# EAGLE design QS40_pcb_1.6.2 (EAGLE 9.6.2)
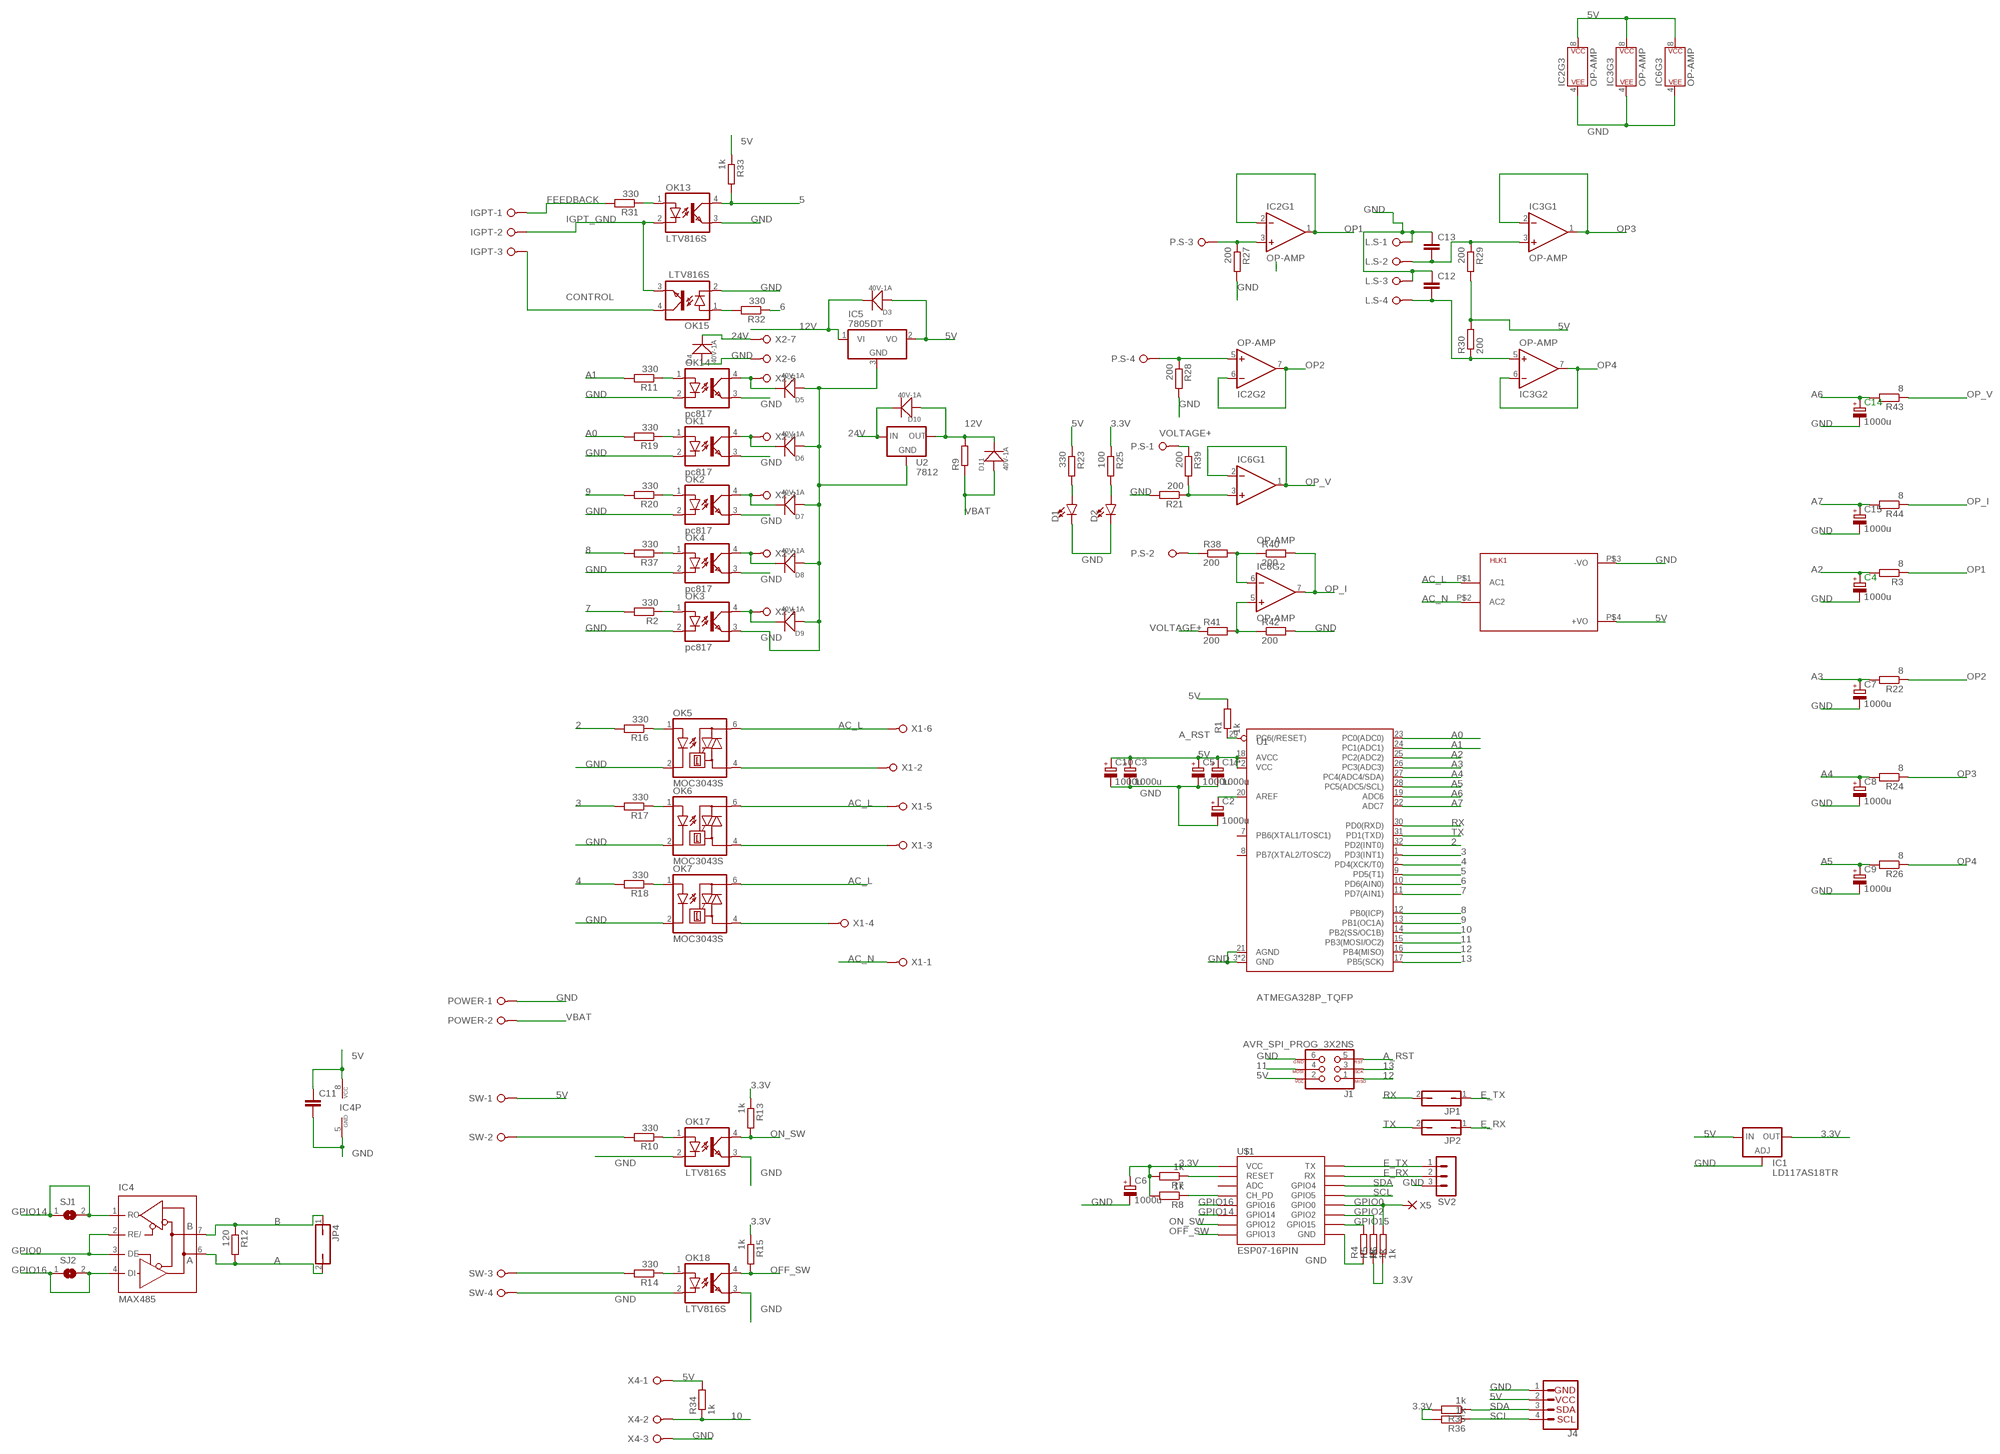
[diagram p0: schematic, sheet 1]

## Parts
C1  1000u  CPOL-EUUD-8X10  [UD-8X10_NICHICON]
C2  1000u  CPOL-EUUD-8X10  [UD-8X10_NICHICON]
C3  1000u  CPOL-EUUD-8X10  [UD-8X10_NICHICON]
C4  1000u  CPOL-EUUD-8X10  [UD-8X10_NICHICON]
C5  1000u  CPOL-EUUD-8X10  [UD-8X10_NICHICON]
C6  1000u  CPOL-EUUD-8X10  [UD-8X10_NICHICON]
C7  1000u  CPOL-EUUD-8X10  [UD-8X10_NICHICON]
C8  1000u  CPOL-EUUD-8X10  [UD-8X10_NICHICON]
C9  1000u  CPOL-EUUD-8X10  [UD-8X10_NICHICON]
C10  1000u  CPOL-EUUD-8X10  [UD-8X10_NICHICON]
C11  C-EUC1206K  [C1206K]
C12  C-EUC1206  [C1206]
C13  C-EUC1206  [C1206]
C14  1000u  CPOL-EUUD-8X10  [UD-8X10_NICHICON]
C15  1000u  CPOL-EUUD-8X10  [UD-8X10_NICHICON]
D1  LED-FKIT-1206  [FKIT-LED-1206]
D2  LED-FKIT-1206  [FKIT-LED-1206]
D3  40V-1A  SMD-DIODE-SCHOTTKY-40V-1A(DO-214AC)  [DO-214AC]
D4  40V-1A  SMD-DIODE-SCHOTTKY-40V-1A(DO-214AC)  [DO-214AC]
D5  40V-1A  SMD-DIODE-SCHOTTKY-40V-1A(DO-214AC)  [DO-214AC]
D6  40V-1A  SMD-DIODE-SCHOTTKY-40V-1A(DO-214AC)  [DO-214AC]
D7  40V-1A  SMD-DIODE-SCHOTTKY-40V-1A(DO-214AC)  [DO-214AC]
D8  40V-1A  SMD-DIODE-SCHOTTKY-40V-1A(DO-214AC)  [DO-214AC]
D9  40V-1A  SMD-DIODE-SCHOTTKY-40V-1A(DO-214AC)  [DO-214AC]
D10  40V-1A  SMD-DIODE-SCHOTTKY-40V-1A(DO-214AC)  [DO-214AC]
D11  40V-1A  SMD-DIODE-SCHOTTKY-40V-1A(DO-214AC)  [DO-214AC]
HLK1  HLK-PM013W  [HLK-PM01]
IC1  LD117AS18TR  [SOT223]
IC2  OP-AMP  OPAMP-DUALU  [SO08]
IC3  OP-AMP  OPAMP-DUALU  [SO08]
IC4  MAX485  MAX481CSA  [SO08]
IC5  7805DT  [TO252]
IC6  OP-AMP  OPAMP-DUALU  [SO08]
IGPT  W237-03P  [W237-133]
J1  AVR_SPI_PROG_3X2NS  [2X3-NS]
J4  I2C_STANDARD_NO_SILK  [1X04_NO_SILK]
JP1  JP1Q  [JP1]
JP2  JP1Q  [JP1]
JP4  JP1Q  [JP1]
L.S  W237-04P  [W237-4P]
OK1  pc817  LTV816S  [DIL4-SMD]
OK2  pc817  LTV816S  [DIL4-SMD]
OK3  pc817  LTV816S  [DIL4-SMD]
OK4  pc817  LTV816S  [DIL4-SMD]
OK5  MOC3043S  [DIL6-SMD]
OK6  MOC3043S  [DIL6-SMD]
OK7  MOC3043S  [DIL6-SMD]
OK13  LTV816S  [DIL4-SMD]
OK14  pc817  LTV816S  [DIL4-SMD]
OK15  LTV816S  [DIL4-SMD]
OK17  LTV816S  [DIL4-SMD]
OK18  LTV816S  [DIL4-SMD]
P.S  W237-04P  [W237-4P]
POWER  W237-02P  [W237-132]
R1  1k  R-EU_R1206W  [R1206W]
R2  330  R-EU_R1206W  [R1206W]
R3  8  R-EU_R1206W  [R1206W]
R4  1k  R-EU_R1206W  [R1206W]
R5  1k  R-EU_R1206W  [R1206W]
R6  1k  R-EU_R1206W  [R1206W]
R7  1k  R-EU_R1206W  [R1206W]
R8  1k  R-EU_R1206W  [R1206W]
R9  R-EU_R5025  [R5025]
R10  330  R-EU_R1206W  [R1206W]
R11  330  R-EU_R1206W  [R1206W]
R12  120  R-EU_R1206W  [R1206W]
R13  1k  R-EU_R1206W  [R1206W]
R14  330  R-EU_R1206W  [R1206W]
R15  1k  R-EU_R1206W  [R1206W]
R16  330  R-EU_R1206W  [R1206W]
R17  330  R-EU_R1206W  [R1206W]
R18  330  R-EU_R1206W  [R1206W]
R19  330  R-EU_R1206W  [R1206W]
R20  330  R-EU_R1206W  [R1206W]
R21  200  R-EU_R1206  [R1206]
R22  8  R-EU_R1206W  [R1206W]
R23  330  R-EU_R1206W  [R1206W]
R24  8  R-EU_R1206W  [R1206W]
R25  100  R-EU_R1206W  [R1206W]
R26  8  R-EU_R1206W  [R1206W]
R27  200  R-EU_R1206  [R1206]
R28  200  R-EU_R1206  [R1206]
R29  200  R-EU_R1206W  [R1206W]
R30  200  R-EU_R1206W  [R1206W]
R31  330  R-EU_R1206W  [R1206W]
R32  330  R-EU_R1206W  [R1206W]
R33  1k  R-EU_R1206W  [R1206W]
R34  1k  R-EU_R1206W  [R1206W]
R35  1k  R-EU_R1206W  [R1206W]
R36  1k  R-EU_R1206W  [R1206W]
R37  330  R-EU_R1206W  [R1206W]
R38  200  R-EU_R1206  [R1206]
R39  200  R-EU_R1206  [R1206]
R40  200  R-EU_R1206  [R1206]
R41  200  R-EU_R1206  [R1206]
R42  200  R-EU_R1206  [R1206]
R43  8  R-EU_R1206W  [R1206W]
R44  8  R-EU_R1206W  [R1206W]
SJ1  SJ  [SJ]
SJ2  SJ  [SJ]
SV2  MA03-1  [MA03-1]
SW  W237-04P  [W237-4P]
U1  ATMEGA328P_TQFP  [TQFP32-08]
U2  7812  V_REG_78XX7812  [TO-252]
U$1  ESP07-16PIN  [ESP07]
X1  W237-06P  [W237-6P]
X2  W237-07P  [W237-7P]
X4  W237-03P  [W237-133]
X5  PAD-1.00-2.00  [PAD-1.00-2.00]

## Nets
2: R16.2 U1.32(PD2(INT0))
3: R17.2 U1.1(PD3(INT1))
3.3V: C6.+ IC1.4(OUT) R5.1 R6.1 R7.2 R8.2 R13.1 R15.1 R25.1 R35.2 R36.2 U$1.VCC
4: R18.2 U1.2(PD4(XCK/T0))
5: OK13.4(COL) R33.2 U1.9(PD5(T1))
5V: C1.+ C3.+ C5.+ C10.+ C11.1 D3.1(+) HLK1.P$4(+VO) IC1.3(IN) IC2.8(P$V+) IC3.8(P$V+) IC4.8(VCC) IC5.2(VO) IC6.8(P$V+) J1.2 J4.2 R1.2 R23.1 R29.2 R30.2 R33.1 R34.2 SW.1 U1.4(VCC) U1.6(VCC) U1.18(AVCC) X4.1
6: R32.1 U1.10(PD6(AIN0))
7: R2.2 U1.11(PD7(AIN1))
8: R37.2 U1.12(PB0(ICP))
9: R20.2 U1.13(PB1(OC1A))
10: R34.1 U1.14(PB2(SS/OC1B)) X4.2
11: J1.4 U1.15(PB3(MOSI/OC2))
12: J1.1 U1.16(PB4(MISO))
12V: D3.2(-) D10.1(+) D11.2(-) IC5.1(VI) R9.2 U2.2(OUT)
13: J1.3 U1.17(PB5(SCK))
24V: D4.2(-) D10.2(-) U2.1(IN) X2.7
A: IC4.6(A) JP4.2 R12.2
A0: R19.2 U1.23(PC0(ADC0))
A1: R11.2 U1.24(PC1(ADC1))
A2: C4.+ R3.2 U1.25(PC2(ADC2))
A3: C7.+ R22.2 U1.26(PC3(ADC3))
A4: C8.+ R24.2 U1.27(PC4(ADC4/SDA))
A5: C9.+ R26.2 U1.28(PC5(ADC5/SCL))
A6: C14.+ R43.2 U1.19(ADC6)
A7: C15.+ R44.2 U1.22(ADC7)
A_RST: J1.5 R1.1 U1.29(PC6(/RESET))
AC_L: HLK1.P$1(AC1) OK5.6(A2) OK6.6(A2) OK7.6(A2) X1.5 X1.6
AC_N: HLK1.P$2(AC2) X1.1
B: IC4.7(B) JP4.1 R12.1
CONTROL: IGPT.3 OK15.4(COL)
E_RX: JP2.1 SV2.2 U$1.RX
E_TX: JP1.1 SV2.1 U$1.TX
FEEDBACK: IGPT.1 R31.2
GND: C1.- C2.- C3.- C4.- C5.- C6.- C7.- C8.- C9.- C10.- C11.2 C12.1 C13.1 C14.- C15.- D1.C D2.C D4.1(+) D5.1(+) D6.1(+) D7.1(+) D8.1(+) D9.1(+) HLK1.P$3(-VO) IC1.1(ADJ) IC2.4(P$V-) IC3.4(P$V-) IC4.5(GND) IC5.3(GND) IC6.4(P$V-) J1.6 J4.1 L.S.1 L.S.3 OK1.2(C) OK1.3(EMIT) OK2.2(C) OK2.3(EMIT) OK3.2(C) OK3.3(EMIT) OK4.2(C) OK4.3(EMIT) OK5.2(C) OK6.2(C) OK7.2(C) OK13.3(EMIT) OK14.2(C) OK14.3(EMIT) OK15.2(C) OK17.2(C) OK17.3(EMIT) OK18.2(C) OK18.3(EMIT) POWER.1 R4.1 R21.2 R27.2 R28.2 R42.2 SV2.3 SW.4 U1.3(GND) U1.5(GND) U1.21(AGND) U2.3(GND) U$1.GND X2.6 X4.3
GPIO0: IC4.2(RE/) IC4.3(DE) R6.2 U$1.GPIO0 X5.1(P)
GPIO2: R5.2 U$1.GPIO2
GPIO14: IC4.1(RO) SJ1.1 SJ1.2 U$1.GPIO14
GPIO15: R4.2 U$1.GPIO15
GPIO16: IC4.4(DI) SJ2.1 SJ2.2 U$1.GPIO16
IGPT_GND: IGPT.2 OK13.2(C) OK15.3(EMIT)
N$1: OK5.4(A1) X1.2
N$2: IC2.3(+IN) P.S.3 R27.1
N$3: R7.1 U$1.REST(RESET)
N$4: R8.1 U$1.CH_PD
N$5: C2.+ U1.20(AREF)
N$6: OK7.4(A1) X1.4
N$7: OK14.1(A) R11.1
N$8: OK3.1(A) R2.1
N$9: OK1.1(A) R19.1
N$10: OK6.4(A1) X1.3
N$11: OK2.1(A) R20.1
N$12: OK4.1(A) R37.1
N$13: C13.2 IC3.3(+IN) L.S.2 R29.1
N$14: D1.A R23.2
N$15: D2.A R25.2
N$16: D5.2(-) OK14.4(COL) X2.5
N$17: D6.2(-) OK1.4(COL) X2.4
N$18: D7.2(-) OK2.4(COL) X2.3
N$19: C12.2 IC3.5(+IN) L.S.4 R30.1
N$20: OK15.1(A) R32.2
N$21: IC2.5(+IN) P.S.4 R28.1
N$22: D8.2(-) OK4.4(COL) X2.2
N$23: D9.2(-) OK3.4(COL) X2.1
N$24: OK17.1(A) R10.1
N$26: P.S.2 R38.1
N$27: OK5.1(A) R16.1
N$29: R10.2 SW.2
N$30: OK18.1(A) R14.1
N$31: IC6.5(+IN) R41.2 R42.1
N$32: IC6.3(+IN) R21.1 R39.2
N$33: OK6.1(A) R17.1
N$34: IC6.6(-IN) R38.2 R40.1
N$35: R14.2 SW.3
N$37: OK7.1(A) R18.1
N$48: OK13.1(A) R31.1
OFF_SW: OK18.4(COL) R15.2 U$1.GPIO13
ON_SW: OK17.4(COL) R13.2 U$1.GPIO12
OP1: IC2.1(OUT) IC2.2(-IN) R3.1
OP2: IC2.6(-IN) IC2.7(OUT) R22.1
OP3: IC3.1(OUT) IC3.2(-IN) R24.1
OP4: IC3.6(-IN) IC3.7(OUT) R26.1
OP_I: IC6.7(OUT) R40.2 R44.1
OP_V: IC6.1(OUT) IC6.2(-IN) R43.1
RX: JP1.2 U1.30(PD0(RXD))
SCL: J4.4 R36.1 U$1.GPIO5
SDA: J4.3 R35.1 U$1.GPIO4
TX: JP2.2 U1.31(PD1(TXD))
VBAT: D11.1(+) POWER.2 R9.1
VOLTAGE+: P.S.1 R39.1 R41.1
Unconnected: U1.7(PB6(XTAL1/TOSC1)) U1.8(PB7(XTAL2/TOSC2)) U$1.ADC

## Library data of the parts
C1-C10 C14 C15 = rcl:CPOL-EU: POLARIZED CAPACITOR, European symbol; SPICEPREFIX: C
C11-C13 = rcl:C-EU: CAPACITOR, European symbol; SPICEPREFIX: C
D1 D2 = SparkFun-LED:LED: LED (Generic) Standard schematic elements and footprints for 5mm, 3mm, 1206, and 0603 sized LEDs. Generic LEDs with no color specified.
D3-D11 = Seeed-OPL-Diode:SMD-DIODE-SCHOTTKY-40V-1A(DO-214AC): 304020027; MPN: 1N5819
HLK1 = HLK-PM01:HLK-PM01: Hi-Link Power Supply HLK-PM01 3W Author: Ahmed Said <https://github.com/AhmedSaid/EAGLELibraries>
IC1 = v-reg:LD117A?*: Low drop fixed and adjustable positive voltage regulators 1 A Source: http://www.st.com/stonline/products/literature/ds/7194/ld1117axx.pdf
IC2 IC3 IC6 = SparkFun-IC-Amplifiers:OPAMP-DUAL: Generic op-amp footprint This component is for the standard 358 pinning of a dual op-amp From the LM358 datasheet: Pin 1: Output A Pin 2: Inverting Input A Pin 3: Non-Inverting Input A Pin 4: Gnd Pin 5: Non-Inverting Input B Pin 6: Inverting Input B Pin 7: Output B Pin 8: V+; PROD_ID: NA-XXXXX
IC4 = maxim:MAX481CSA: RS485 TRANSEIVER; MF: MAXIM; MPN: MAX481CSA; OC_FARNELL: unknown; OC_NEWARK: 90C3817
IC5 = linear:78*: Positive VOLTAGE REGULATOR Source: http://cache.national.com/ds/LM/LM78L05.pdf http://www.fairchildsemi.com/ds/LM/LM7805.pdf
IGPT X4 = con-wago-508:W237-03P: WAGO SREW CLAMP; OC_FARNELL: unknown; OC_NEWARK: unknown
J1 = SparkFun-Connectors:AVR_SPI_PROG_3X2: AVR ISP 6 Pin This is the reduced ISP connector for AVR programming. Common on Arduino. This footprint will take up less PCB space and can be used with a 10-pin to 6-pin adapter such as SKU: BOB-08508 **Special note about "TEST_POINT" package. The stop mask is on the top side, so if you want your programming test points to be on the bottom of your board, make sure to place this package on the bottom side of the board. This also ensure that the orientation to program from the bottom side will be correct. SparkFun Products: SparkFun ISP Pogo Adapter <https://www.sparkfun.com/products/11591> - NS Tiny AVR Programmer <https://www.sparkfun.com/products/11801> -PTH
J4 = SparkFun-Connectors:I2C_STANDARD: SparkFun I2C Standard Pinout Header SparkFun has standardized on a pinout for all I2C based sensor breakouts. This pinout allows I2C boards to be plugged directly into the headers on Arduino Uno compatible boards, and to be daisy chained easily. Example SparkFun Products: SparkFun Atmospheric Sensor Breakout - BME280 <https://www.sparkfun.com/products/13676> SparkFun Altitude/Pressure Sensor Breakout - MPL3115A2 <https://www.sparkfun.com/products/11084> SparkFun TOF Range Finder Sensor - VL6180 <https://www.sparkfun.com/products/12785>
JP1 JP2 JP4 = jumper:JP1Q: JUMPER
L.S P.S SW = con-wago-508:W237-04P: WAGO SREW CLAMP; OC_FARNELL: unknown; OC_NEWARK: unknown
OK1-OK4 OK13-OK15 OK17 OK18 = optocoupler:LTV816: OPTO COUPLER Source: LITEON, LTV816.pdf
OK5-OK7 = optocoupler:MOC30*: 6-Pin DIP Zero-Cross Optoisolators Triac Driver Output (250/400 Volt Peak) Source: Data sheet <http://www.fairchildsemi.com/ds/MO/MOC3031M.pdf> The old path of data sheet not more available 2013-05-06.; MF: FAIRCHILD SEMICONDUCTOR; MPN: MOC3043SM; OC_FARNELL: 1505441; OC_NEWARK: 78K6091
POWER = con-wago-508:W237-02P: WAGO SREW CLAMP; OC_FARNELL: unknown; OC_NEWARK: unknown
R1-R44 = rcl:R-EU_: RESISTOR, European symbol; SPICEPREFIX: R
SJ1 SJ2 = jumper:SJ: SMD solder JUMPER
SV2 = con-lstb:MA03-1: PIN HEADER; OC_FARNELL: unknown; OC_NEWARK: unknown
U1 = SparkFun-IC-Microcontroller:ATMEGA328P_TQFP: Popular 328P in QFP Storefront component: ATmega328 - TQFP <https://www.sparkfun.com/products/13448> (COM-13448) Datasheet <http://www.sparkfun.com/datasheets/Components/SMD/ATMega328.pdf> SparkFun Products SparkFun RedBoard - Programmed with Arduino <https://www.sparkfun.com/products/12757> (DEV-12757) Arduino Pro Mini 328 - 5V/16MHz <https://www.sparkfun.com/products/11113> (DEV-11113) Arduino Pro Mini 328 - 3.3V/8MHz <https://www.sparkfun.com/products/11114> (DEV-11114) SparkFun OpenLog <https://www.sparkfun.com/products/13712> (DEV-13712) SparkFun MicroView - OLED Arduino Module <https://www.sparkfun.com/products/12923> (DEV-12923) SparkFun Digital Sandbox <https://www.sparkfun.com/products/12651> (DEV-12651) SparkFun PicoBoard <https://www.sparkfun.com/products/11888> (WIG-11888) Arduino Fio <https://www.sparkfun.com/products/10116> (DEV-10116) LilyPad Arduino 328 Main Board <https://www.sparkfun.com/products/13342> (DEV-13342) SparkFun RedStick <https://www.sparkfun.com/products/13741> (DEV-13741) LilyPad MP3 <https://www.sparkfun.com/products/11013> (DEV-11013) LilyPad Arduino SimpleSnap <https://www.sparkfun.com/products/10941> (DEV-10941) SparkFun Stepoko <https://www.sparkfun.com/products/13899> (ROB-13899) SparkFun Geiger Counter <https://www.sparkfun.com/products/11345> (SEN-11345) SparkFun EL Sequencer <https://www.sparkfun.com/products/12781> (COM-12781) Arduino Pro 328 - 5V/16MHz <https://www.sparkfun.com/products/10915> (DEV-10915) CryptoCape <https://www.sparkfun.com/products/12773> (DEV-12773) SparkFun IR Thermometer Evaluation Board - MLX90614 <https://www.sparkfun.com/products/10740> (SEN-10740) SparkFun RedBot Mainboard <https://www.sparkfun.com/products/12097> (ROB-12097) Arduino Pro 328 - 3.3V/8MHz <https://www.sparkfun.com/products/10914> (DEV-10914) SparkFun Block for Intel® Edison - Arduino <https://www.sparkfun.com/products/13036> (DEV-13036) SparkFun Simon Says - Surface Mount Soldering Kit <https://www.sparkfun.com/products/10935> (KIT-10935) SparkFun 7-Segment Serial Display - Red <https://www.sparkfun.com/products/11441> (COM-11441) SparkFun 7-Segment Serial Display - White <https://www.sparkfun.com/products/11629> (COM-11629) SparkFun 7-Segment Serial Display - Yellow <https://www.sparkfun.com/products/11443> (COM-11443) SparkFun 7-Segment Serial Display - Kelly Green <https://www.sparkfun.com/products/11440> (COM-11440) SparkFun 7-Segment Serial Display - Blue <https://www.sparkfun.com/products/11442> (COM-11442) SparkFun OpenSegment Serial Display - 20mm (Blue) <https://www.sparkfun.com/products/11647> (COM-11647) SparkFun OpenSegment Serial Display - 20mm (Green) <https://www.sparkfun.com/products/11646> (COM-11646) SparkFun OpenSegment Serial Display - 20mm (White) <https://www.sparkfun.com/products/11648> (COM-11648) SparkFun OpenSegment Serial Display - 20mm (Red) <https://www.sparkfun.com/products/11644> (COM-11644) SparkFun OpenSegment Serial Display - 20mm (Yellow) <https://www.sparkfun.com/products/11645> (COM-11645) SparkFun OpenSegment Shield <https://www.sparkfun.com/products/13190> (DEV-13190); PROD_ID: IC-09069
U2 = SparkFun-IC-Power:V_REG_78XX: Voltage Regulator Standard 78xx regulator. IGO (Input Ground Output). Spark Fun Electronics SKU : COM-00107; PROD_ID: VREG-12370; VALUE: +12v
U$1 = SparkFun-RF:ESP07-16PIN: Espressif ESP-07S WiFi-compatible SoC microcontroller. 16 GPIO pins User Guide <https://www.tinyosshop.com/datasheet/ESP-07S_User_Manual.pdf>; PROD_ID: IC-13915
X1 = con-wago-508:W237-06P: WAGO SREW CLAMP; OC_FARNELL: unknown; OC_NEWARK: unknown
X2 = con-wago-508:W237-07P: WAGO SREW CLAMP; OC_FARNELL: unknown; OC_NEWARK: unknown
X5 = we-rcl:PAD: Pad / Test-Point

## Board
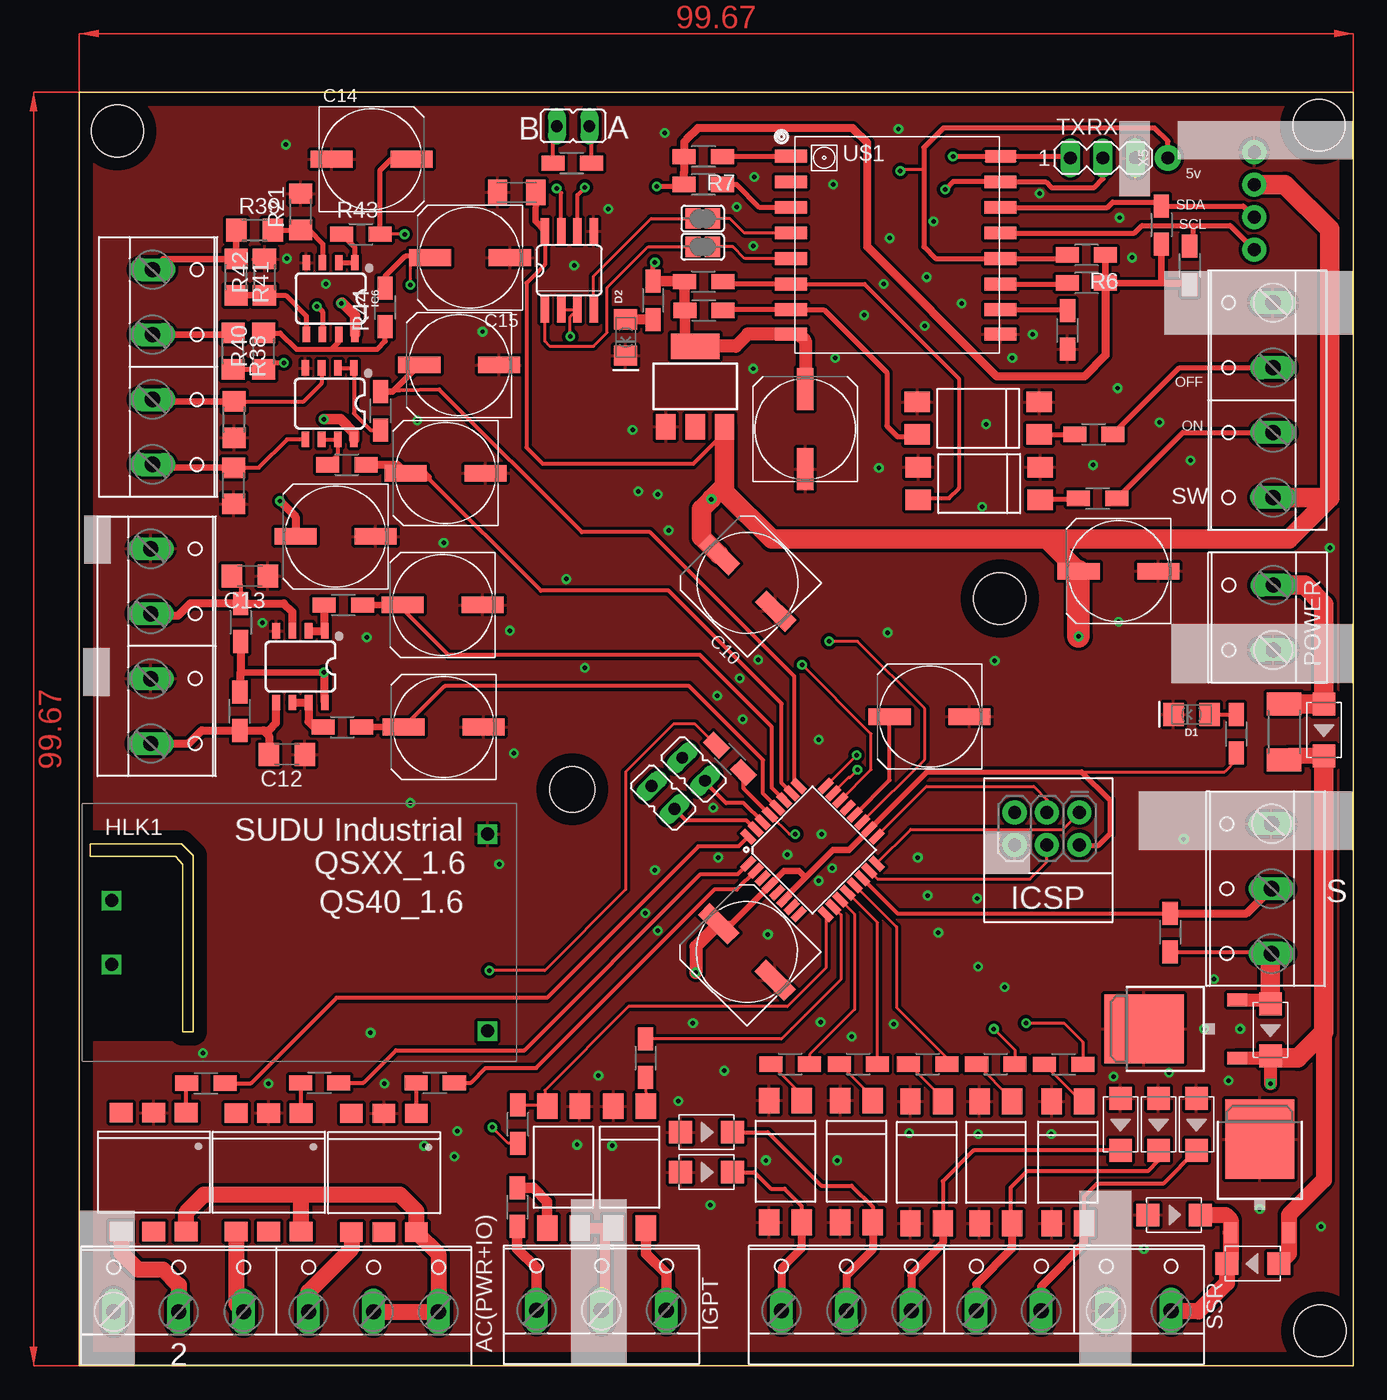
[diagram p1: board, top side]
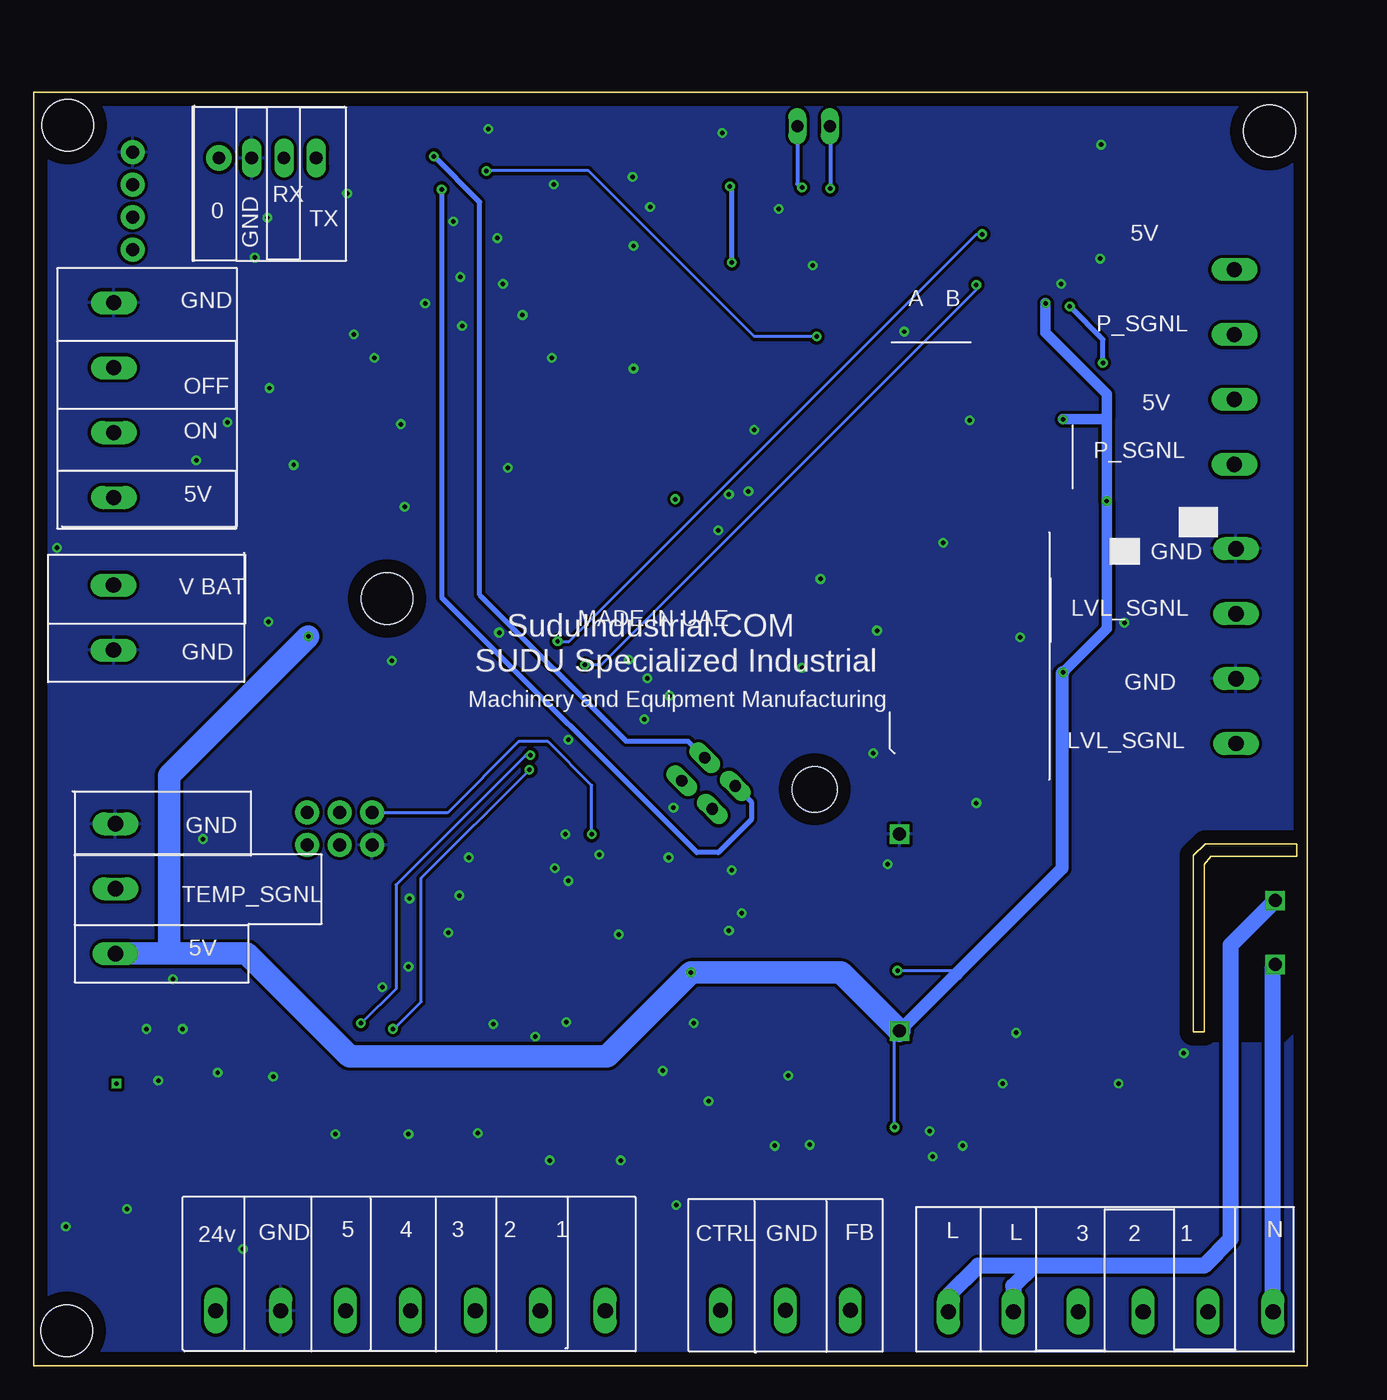
[diagram p2: board, bottom side, seen from below]

Size 99.67 x 99.67 mm. Coordinates in mm from the lower left corner, seen from the top.
Outline: 0,99.67 0,0 99.67,0 99.67,99.67 0,99.67
Outline: 0.84,40.84 8,40.84 8.92,39.93 8.92,26.14 8.08,26.14 8.08,39.24 7.54,39.85 0.84,39.85 0.84,40.84
Copper layers (1*16): Top 0.035mm / dielectric 1.5mm / Bottom 0.035mm
Design rules "default": minimum track width 6mil, minimum drill 0.35mm, track to track 6mil, track to pad 6mil, pad to pad 6mil, via to via 6mil, smd to smd 6mil, copper to edge 40mil, drill to drill 6mil, minimum pad ring 10mil, minimum via ring 8mil, stop-mask expansion 4mil, vias tented up to drill 0mil, thermal gap 10mil
Holes 4.06 mm at 97.08,2.74 2.97,96.62 97,97.08 72.01,60.05
Holes 3.56 mm at 38.56,45.11

### Footprints (pad centres in the part's own frame; a part is rotated, then mirrored left to right if it is on the bottom)
UD-8X10_NICHICON = smd 3.3 x 1.3: + 3.125,0; - -3.125,0
C1206K = smd 1.5 x 2: 1 -1.5,0; 2 1.5,0
C1206 = smd 1.6 x 1.8: 1 -1.4,0; 2 1.4,0
FKIT-LED-1206 = smd 1.6 x 1.803: A -1.422,0; C 1.422,0
DO-214AC = smd 1.8 x 1.77: 1 -2.042,0; 2 2.042,0
HLK-PM01 = drill 1.016 square: P$1 -14.7,2.5; P$2 -14.7,-2.5; P$3 14.7,7.7; P$4 14.7,-7.7
SOT223 = smd 1.5 x 2: 1 -2.3,-3.15; 2 0,-3.15; 3 2.3,-3.15 | smd 3.8 x 2: 4 0,3.15
SO08 = smd 0.6 x 1.2: 1 -1.905,-2.8; 2 -0.635,-2.8; 3 0.635,-2.8; 4 1.905,-2.8; 5 1.905,2.8; 6 0.635,2.8; 7 -0.635,2.8; 8 -1.905,2.8
SO08' = smd 0.66 x 2.032: 1 -1.905,-3.073; 2 -0.635,-3.073; 3 0.635,-3.073; 4 1.905,-3.073; 5 1.905,3.073; 6 0.635,3.073; 7 -0.635,3.073; 8 -1.905,3.073
TO252 = smd 1 x 1.6: 1 -2.28,-4.8; 2 2.28,-4.8 | smd 5.4 x 6.2: 3 0,2.5
W237-133 = drill 1.194 long: 1 -5.08,-0.635; 2 0,-0.635; 3 5.08,-0.635
2X3-NS = drill 1.016 pad 1.88: 1 -2.54,-1.27; 2 -2.54,1.27; 3 0,-1.27; 4 0,1.27; 5 2.54,-1.27; 6 2.54,1.27
1X04_NO_SILK = drill 1.016 pad 1.88: 1 0,0; 2 2.54,0; 3 5.08,0; 4 7.62,0
JP1 = drill 0.914 long: 1 0,-1.27; 2 0,1.27
W237-4P = drill 1.194 long: 1 -7.62,-0.635; 2 -2.54,-0.635; 3 2.54,-0.635; 4 7.62,-0.635
DIL4-SMD = smd 1.6 x 2: 1 -1.27,-4.77; 2 1.27,-4.77; 3 1.27,4.77; 4 -1.27,4.77
DIL6-SMD = smd 1.78 x 1.52: 1 -2.54,-4.645; 2 0,-4.645; 3 2.54,-4.645; 4 2.54,4.645; 5 0,4.645; 6 -2.54,4.645
W237-132 = drill 1.194 long: 1 -2.54,-0.635; 2 2.54,-0.635
R1206W = smd 1.8 x 1.2: 1 -1.499,0; 2 1.499,0
R5025 = smd 1.8 x 2.7: 1 -2.2,0; 2 2.2,0
R1206 = smd 1.6 x 1.803: 1 -1.422,0; 2 1.422,0
SJ = smd 1.168 x 1.6: 1 -0.762,0; 2 0.762,0
MA03-1 = drill 1.016 long: 1 -2.54,0; 2 0,0; 3 2.54,0
TQFP32-08 = smd 1.27 x 0.559: 1 -4.293,2.8; 2 -4.293,2; 3 -4.293,1.2; 4 -4.293,0.4; 5 -4.293,-0.4; 6 -4.293,-1.2; 7 -4.293,-2; 8 -4.293,-2.8; 17 4.293,-2.8; 18 4.293,-2; 19 4.293,-1.2; 20 4.293,-0.4; 21 4.293,0.4; 22 4.293,1.2; 23 4.293,2; 24 4.293,2.8 | smd 0.559 x 1.27: 9 -2.8,-4.293; 10 -2,-4.293; 11 -1.2,-4.293; 12 -0.4,-4.293; 13 0.4,-4.293; 14 1.2,-4.293; 15 2,-4.293; 16 2.8,-4.293; 25 2.8,4.293; 26 2,4.293; 27 1.2,4.293; 28 0.4,4.293; 29 -0.4,4.293; 30 -1.2,4.293; 31 -2,4.293; 32 -2.8,4.293
TO-252 = smd 1 x 1.6: 1 -2.28,-4.8; 2 2.28,-4.8 | smd 5.4 x 6.2: 3 0,2.5
ESP07 = smd 2.5 x 1: ADC -8.026,3.841; CH_PD -8.026,1.841; GND 8.374,-8.064; GPIO0 8.374,-2.159; GPIO2 8.374,-4.159; GPIO4 8.374,1.841; GPIO5 8.374,-0.159; GPIO12 -8.026,-4.159; GPIO13 -8.026,-6.159; GPIO14 -8.026,-2.159; GPIO15 8.374,-6.159; GPIO16 -8.026,-0.159; REST -8.026,5.841; RX 8.374,3.841; TX 8.374,5.841; VCC -8.026,-8.064
W237-6P = drill 1.194 long: 1 -12.7,-0.635; 2 -7.62,-0.635; 3 -2.54,-0.635; 4 2.54,-0.635; 5 7.62,-0.635; 6 12.7,-0.635
W237-7P = drill 1.194 long: 1 -15.24,-0.635; 2 -10.16,-0.635; 3 -5.08,-0.635; 4 0,-0.635; 5 5.08,-0.635; 6 10.16,-0.635; 7 15.24,-0.635
PAD-1.00-2.00 = drill 1 pad 2: 1 0,0

### Placement (x,y rotation side)
C1  81.31,62.18 180 top
C2  66.52,50.8 180 top
C3  20.04,64.9 180 top
C4  29.72,78.31 180 top
C5  52.22,32.38 135 top
C6  56.79,73.3 90 top
C7  28.65,69.85 180 top
C8  28.42,59.54 180 top
C9  28.5,49.99 180 top
C10  52.27,61.26 135 top
C11  34.21,91.82 180 top
C12  16.23,47.85 180 top
C13  13.34,61.8 180 top
C14  22.86,94.41 0 top
C15  30.56,86.72 180 top
D1  87.02,50.98 180 top
D2  42.75,80.47 270 top
D3  93.19,26.29 270 top
D4  85.65,11.81 0 top
D5  87.4,18.9 270 top
D6  84.43,18.9 270 top
D7  81.46,18.9 270 top
D8  49.07,18.29 0 top
D9  49.07,15.16 0 top
D10  91.82,8 180 top
D11  97.38,49.76 270 top
HLK1  17.22,33.91 0 top
IC1  48.18,76.63 0 top
IC2  19.58,75.29 180 top
IC3  17.3,54.71 180 top
IC4  MAX485  [SO08']  38.33,85.72 0 top
IC5  85.8,26.37 90 top
IC6  19.66,83.52 180 top
IGPT  40.84,4.98 0 top
J1  75.72,42.04 180 top
J4  91.92,94.97 270 top
JP1  48.06,46.69 225 top
JP2  45.67,44.48 225 top
JP4  38.63,97 270 top
L.S  6.22,56.31 270 top
OK1  71.7,15.93 180 top
OK2  66.29,15.93 180 top
OK3  55.25,16 180 top
OK4  60.81,16 180 top
OK5  5.82,15.16 180 top
OK6  14.81,15.14 180 top
OK7  23.83,15.11 180 top
OK13  37.87,15.54 0 top
OK14  77.34,15.93 180 top
OK15  43.05,15.54 180 top
OK17  70.41,69.04 90 top
OK18  70.33,74.14 90 top
P.S  6.35,78.16 270 top
POWER  92.79,58.55 90 top
R1  50.9,47.5 135 top
R2  55.63,23.62 0 top
R3  23.57,74.73 90 top
R4  77.32,81.05 90 top
R5  78.79,84.73 180 top
R6  78.79,86.92 180 top
R7  48.82,94.62 180 top
R8  48.82,92.43 180 top
R9  94.26,49.61 270 top
R10  79.68,67.87 0 top
R11  77.01,23.6 0 top
R12  38.56,94.11 0 top
R13  48.84,84.84 0 top
R14  79.37,72.9 0 top
R15  48.87,82.58 0 top
R16  9.91,22.12 0 top
R17  18.8,22.15 0 top
R18  27.84,22.15 0 top
R19  71.7,23.62 0 top
R20  66.37,23.62 0 top
R21  17.3,90.3 90 top
R22  20.93,70.51 0 top
R23  90.53,49.45 90 top
R24  20.65,59.54 0 top
R25  44.88,83.36 270 top
R26  20.57,49.99 0 top
R27  12.12,74.04 270 top
R28  12.07,68.86 270 top
R29  12.62,58.17 270 top
R30  12.55,51.23 90 top
R31  34.26,12.42 270 top
R32  44.3,24.08 270 top
R33  34.31,18.92 90 top
R34  85.34,33.91 270 top
R35  84.66,89.26 270 top
R36  86.87,86.11 270 top
R37  60.96,23.62 0 top
R38  12.04,79.4 270 top
R39  13.72,88.85 0 top
R40  14.4,79.4 90 top
R41  12.27,85.19 270 top
R42  14.48,85.19 90 top
R43  22.02,88.54 0 top
R44  23.93,82.83 90 top
SJ1  48.77,87.55 180 top
SJ2  48.77,89.76 180 top
SV2  80.09,94.51 0 top
SW  92.76,75.56 90 top
U1  57.35,40.36 45 top
U2  92.35,15.24 0 top
U$1  63.7,88.8 0 top
X1  15.39,4.88 0 top
X2  70.18,4.95 0 top
X4  92.63,37.34 90 top
X5  85.17,94.51 0 top

### Tracks (layer width: path | path; a pad name or v marks a point on that pad's centre or on a via)
2
  Top 0.305: R16.2 13.44,22.12 20.12,28.8 36.58,28.8 48.43,40.65 51.58,40.65 U1.32
3
  Top 0.305: R17.2 22.23,22.15 24.77,24.69 34.82,24.69 48.62,38.48 51.51,38.48 U1.1
3.3V  (via drill 0.35)
  Top 0.305: 47.09,84.86 47.32,84.86 R13.1 | IC1.4 47.37,80.59 R15.1 | 60.58,96.77 60.5,96.85 | 47.47,95.94 47.32,95.78 | 47.32,94.87 R7.2 | R8.2 47.17,92.28
  Top 0.406: 47.35,82.6 R15.1 | R25.1 44.88,86.18 v45.03,86.34 | 47.17,92.28 v45.19,92.28
  Top 0.508: R6.1 R5.1 84.58,84.73 | 84.58,84.73 86.74,84.73 R36.2 | R35.2 84.66,84.81 84.58,84.73
  Top 0.61: R5.1 80.29,79.07 78.64,77.42 71.78,77.42 61.65,87.55 61.65,95.71 60.58,96.77 | 60.5,96.85 48.39,96.85 47.47,95.94 | 47.32,95.78 47.32,94.87 | R7.2 47.32,93.42 R8.2
  Top 0.813: IC1.4 | 48.84,79.78 IC1.4 | 56.79,77.19 C6.+ | R25.1 47.09,84.86 | R13.1 47.35,82.6 | R15.1 47.37,79.6 47.32,79.55 47.96,79.55 IC1.4
  Top 1.016: 48.84,79.78 51.36,79.78 52.31,80.73 U$1.VCC 56.27,80.73 56.79,80.21 56.79,77.19
  Bottom 0.406: v45.03,86.34 45.03,92.13 v45.19,92.28
4
  Top 0.305: R18.2 30.63,22.15 31.8,23.32 35.74,23.32 49.68,37.26 51.43,37.26 U1.2
5
  Top 0.254: U1.9 58.41,31.13 55.4,28.12 42.98,28.12 36.42,21.56 36.42,20.5 36.34,20.42 R33.2
  Top 1.016: 36.42,20.5 OK13.4
5V  (via drill 0.35)
  Top 0.254: 19.2,54.18 v19.13,54.25 | R1.2 48.18,50.22 46.48,50.22 42.75,46.48 42.75,37.26 36.42,30.94 v32.08,30.94 | R33.1 33.55,17.42 v32.31,18.67 | 78.41,46.48 89.61,46.48 90.53,47.4 R23.1
  Top 0.305: 55.17,36.57 U1.6 | 50.37,34.59 C5.+ | 78.33,40.69 J1.2 | IC1.3 50.48,73.03 48.02,70.56 36.27,70.56 34.98,71.86 34.98,84.73 36.42,86.18 IC4.8 36.37,88.8 | R34.2 93.12,32.41 X4.1
  Top 0.406: U1.18 66.3,46.48 78.41,46.48 80.62,44.27 80.62,41.6 79.71,40.69 78.33,40.69
  Top 0.508: U1.18 60.21,40.39 58.98,40.39 56.81,38.21 | 56.81,38.21 55.17,36.57 | 56.81,38.21 56.31,38.71 55.14,38.71 U1.4 51.02,34.59 50.37,34.59 | IC4.8 35.68,89.55 C11.1 | v19.13,54.25 12.7,54.25 12.62,54.33
  Top 0.61: IC3.8 19.2,54.18 | v15.7,67.67 16.92,66.45 C3.+ | R29.2 12.62,54.33 12.62,52.81 R30.2
  Top 0.813: IC2.8 21.49,73 20.42,74.07 v19.13,74.07 | IC6.8 21.56,82.16 20.55,83.18 v20.5,83.13
  Top 1.016: 50.48,68.39 50.48,68.88 | C5.+ 48.23,32.82 v48.23,30.78 | v49.45,67.82 49.45,67.85 48.69,67.09 48.69,65.68 | IC5.2 92.88,28.64 D3.1
  Top 1.524: 97.83,67.89 97.83,88.92 94.32,92.43 J4.2 | C1.+ 75.67,64.69 | 75.67,64.69 54.18,64.69 50.48,68.39 | 49.45,67.85 50.48,68.88 IC1.3 | v49.45,67.82 48.69,67.06 48.69,65.68 48.69,64.85 C10.+ | 75.67,64.69 94.63,64.69 97.83,67.89 | SW.1 97.78,67.94 97.83,67.89 | D3.1 93.19,32.33 93.12,32.41
  Top 1.778: v78.18,57.07 C1.+
  Bottom 0.254: 18.9,54.48 v19.13,54.25 | v32.31,18.67 32.31,25.82 HLK1.P$4 | v32.08,30.94 27.74,30.94 27.47,30.66
  Bottom 0.813: 18.9,54.48 15.7,57.68 v15.7,67.67 15.7,74.14 | v20.5,83.13 20.5,80.85 15.7,76.05 15.7,74.14 | v19.13,74.07 15.77,74.07 15.7,74.14
  Bottom 1.016: v19.13,54.25 19.2,54.18 19.2,38.93 27.47,30.66 HLK1.P$4
  Bottom 1.778: X4.1 89.61,32.26 | 89.61,32.26 82.98,32.26 74.96,24.23 54.79,24.23 v48.23,30.78 36.5,30.78 HLK1.P$4 | 89.61,32.26 89.08,32.79 89.08,46.18 v78.18,57.07
6
  Top 0.254: U1.10 59.59,35.3 59.59,30.25 54.92,25.58 R32.1
7
  Top 0.254: U1.11 60.66,35.36 60.66,27.89 57.13,24.36 R2.2
8
  Top 0.254: R37.2 62.46,34.69 U1.12
9
  Top 0.254: U1.13 63.93,34.35 63.93,28.04 67.87,24.1 R20.2
10
  Top 0.305: U1.14 64,35.41 R34.1
  Top 0.61: R34.1 91.34,35.41 X4.2
11
  Top 0.254: U1.15 62.44,38.1 74.37,38.1 75.72,39.45 J1.4
12
  Top 0.254: U1.16 65.05,41.99 76.94,41.99 J1.1
12V  (via drill 0.35)
  Top 1.016: IC5.1 93.03,24.09 D3.2 v93.19,22.1
  Top 1.27: 97.38,26.14 97.38,14.55 94.63,11.8 U2.2 94.63,8.77 D10.1 | D11.2 94.57,47.72 R9.2
  Top 1.524: D11.2 97.38,26.14 95.33,24.09 93.03,24.09
13
  Top 0.254: U1.17 66.29,45.34 74.68,45.34 75.72,44.3 J1.3
24V
  Top 1.27: X2.7 85.47,4.27 87.55,4.27 89.78,6.49 D10.2 90.07,8.3 U2.1 90.07,11.42 89.69,11.81 D4.2
A  (via drill 0.35)
  Top 0.305: IC4.6 38.96,91.62 v39.55,92.2 | R12.2 40.06,96.85 JP4.2
  Bottom 0.305: JP4.2 39.9,92.48 39.62,92.2 v39.55,92.2
A0  (via drill 0.35)
  Top 0.254: v71.55,26.36 73.2,24.71 R19.2 | v60.88,46.63 60.27,46.02 60.19,46.02 U1.23
  Bottom 0.254: v71.55,26.36 71.48,26.36 69.34,28.5 69.34,38.18 v60.88,46.63
A1  (via drill 0.35)
  Top 0.254: v74.07,26.82 77.04,26.82 78.51,25.35 R11.2 | v60.81,47.78 v60.81,47.77 U1.24
  Bottom 0.254: v74.07,26.82 73.99,26.82 71.32,29.49 71.32,37.64 61.19,47.78 v60.81,47.78
A2
  Top 0.305: U1.25 55.93,45.74 55.93,53.95 44.65,65.23 39.32,65.23 28.15,76.4 23.63,76.28 R3.2 | 26.59,77.95 26.24,77.95
  Top 0.508: 26.24,77.95 C4.+ 24.51,76.22 R3.2
A3
  Top 0.305: U1.26 54.94,45.6 54.94,51.82 46.1,60.66 36.12,60.66 27.25,69.52 | C7.+ 25.53,69.8 25.53,69.52
  Top 0.61: R22.2 24.87,70.51 C7.+ | 27.25,69.52 26.98,69.8 25.53,69.8
A4
  Top 0.305: U1.27 54.18,45.23 54.18,49.99 48.54,55.63 28.88,55.63 25.3,59.21 C8.+
  Top 0.508: R24.2 C8.+
A5
  Top 0.305: U1.28 53.49,44.79 53.49,47.4 47.7,53.19 28.58,53.19 C9.+
  Top 0.508: R26.2 C9.+
A6  (via drill 0.35)
  Top 0.254: U1.19 66.14,47.45 66.14,51.44 60.88,56.69 v58.67,56.69 | v25.45,88.54 R43.2
  Top 0.406: R43.2 23.52,93.55 24.38,94.41 C14.+
  Bottom 0.254: v58.67,56.69 57.76,56.69 25.91,88.54 v25.45,88.54
A7  (via drill 0.35)
  Top 0.254: U1.22 61.95,46.66 61.95,49.45 v56.54,54.86 | v25.91,84.58 25.91,86.72 26.06,86.87
  Top 0.406: R44.2 23.93,85.27 25.53,86.87 26.06,86.87 27.28,86.87 C15.+
  Bottom 0.254: v56.54,54.86 55.25,54.86 25.91,84.2 v25.91,84.58
A_RST  (via drill 0.35)
  Top 0.254: U1.29 55.54,41.6 v56.01,41.6
  Top 0.305: U1.29 51.96,45.19 R1.1
  Bottom 0.254: v56.01,41.6 56.01,45.41 59.44,48.84 61.72,48.84 67.28,43.28 73.15,43.28 J1.5
AC_L
  Top 1.27: OK5.6 8.36,12.01 9.75,13.41 17.3,13.41 | 17.3,13.41 25.07,13.41 26.37,12.12 OK7.6 28.09,8.74 X1.6 X1.5 | OK6.6 17.35,13.36 17.3,13.41
  Bottom 1.27: HLK1.P$1 6.02,32.91 6.02,9.91 8.08,7.85 21.41,7.85 | X1.6 28.09,3.79 28.04,3.73 28.04,5.56 25.76,7.85 21.41,7.85 | 21.41,7.85 23.01,6.25 X1.5
AC_N
  Bottom 1.27: X1.1 2.69,31.24 HLK1.P$2
B  (via drill 0.35)
  Top 0.305: IC4.7 37.69,91.77 v37.34,92.13 | R12.1 37.06,96.7 JP4.1
  Bottom 0.305: JP4.1 37.34,96.98 v37.34,92.13
CONTROL
  Top 0.813: OK15.4 44.32,8.79 45.92,7.19 IGPT.3
E_RX  (via drill 0.35)
  Top 0.406: SV2.2 80.09,92.89 79.4,92.2 76.05,92.2 75.61,92.64 U$1.RX 72.06,92.66 68.35,92.66 v67.74,92.05
  Bottom 0.406: JP2.1 43.51,44.11 43.51,42.75 46.1,40.16 47.78,40.16 67.74,60.12 v67.74,92.05
E_TX  (via drill 0.35)
  Top 0.406: SV2.1 77.42,94.64 U$1.TX v68.35,94.64
  Bottom 0.406: JP1.1 48.45,48.88 53.33,48.88 64.77,60.32 64.77,91.06 v68.35,94.64
FEEDBACK
  Top 0.813: R31.2 34.26,9.17 35.76,7.67 IGPT.1
GND  (via drill 0.35)
  other vias: 38.1,61.57 81.31,58.22 66.14,81.38 62.56,70.26 74.6,80.7 16.15,95.55 31.55,80.92 43.74,68.43 33.68,57.53 33.99,47.93 53.87,33.76 55.4,40 49.99,39.78 26.97,17.22 49.61,43.66 51.66,53.8 49.91,52.43 53.11,55.24 28.5,64.39 23.85,22.1 9.68,24.46 29.34,16.38 14.78,22.1 60.43,25.76 46.86,20.73 40.61,22.71 70.26,36.58 63.7,26.75 72.39,29.64 70.33,31.24 81.38,89.84 82.37,86.72 58.06,41.61 58.9,38.94 57.84,37.95 66.83,89.53 70.64,67.21 63.25,57.38 66.29,85.19 63.4,88.24 61.42,82.22 62.94,84.66 75.13,91.74 45.03,38.79 45.26,68.2 38.71,86.11 44.27,35.43 29.57,18.36 84.51,73.84 81.23,76.5 52.73,87.63 52.81,93.04 58.98,92.43 26.44,73.99 22.48,57 46.1,65.38 43.28,73.23 39.55,54.64 14.33,58.14 67.21,33.91 66.37,36.8 65.61,39.78 22.78,26.06 86.94,70.87 57.99,26.9 48.01,26.82 53.72,16.08 59.28,16.08 64.92,18.21 70.33,18.14 76.05,18.14 25.91,44.04 45.8,96.47 69.04,83.13 73,78.87 59.13,78.87 52.73,78.03 41.38,90.53 45.26,34.06 88.01,26.37 80.92,22.63 85.27,22.94 89.92,22.33 92.35,12.27 90.83,26.37 86.41,41.22 88.77,30.25 49.38,12.57 38.94,17.3 41.68,17.22 71.63,55.17 57.84,49 64.08,96.77 32.84,39.24 50.44,23.09 83.29,9.14 97.16,10.9 97.84,64.01 70.94,73.69 79.32,70.48 19.28,84.66 51.89,50.6 51.44,90.68 16.23,86.64
  pour Top (isolate 0.254): -1.52,102.79 102.57,102.79 102.57,78.18 102.57,-3.51 64.77,-3.51 -2.74,-3.51 -2.74,102.72 -2.74,102.79 -1.6,102.79
  pour Bottom (isolate 0.254): -3.58,103.78 -3.58,-5.72 10.97,-5.72 105.54,-5.72 105.54,24.61 105.54,108.2 43.59,108.2 -3.58,108.2
  cutout Bottom: 0.69,40.92 8.08,40.92 8.92,40.08 8.92,25.37 1.83,25.37 0.69,26.52
  cutout Top: 0.53,41.68 8.23,41.68 9.14,40.77 9.68,40.23 9.68,36.8 9.68,25.45 0.08,25.45 0.08,41.68
GPIO0  (via drill 0.35)
  Top 0.254: IC4.2 IC4.3 38.41,82.09 v38.41,80.54 | v64.24,93.5 64.39,93.65 66.07,93.65
  Top 0.406: R6.2 77.01,86.64 U$1.GPIO0 66.98,86.64 66.07,87.55 66.07,93.65 66.07,95.33 67.59,96.85 84.13,96.85 85.17,95.81 X5.1
  Bottom 0.254: v38.41,80.54 43.28,80.54 56.24,93.5 v64.24,93.5
GPIO2
  Top 0.406: U$1.GPIO2 77.2,84.64 R5.2
GPIO14
  Top 0.254: U$1.GPIO14 52.04,86.64 51.13,87.55 SJ1.1 SJ1.2 44.5,87.55 41.3,84.35 41.3,80.85 40.23,79.78 36.8,79.78 36.42,80.16 IC4.1
GPIO15
  Top 0.406: U$1.GPIO15 77.23,82.64 R4.2
GPIO16
  Top 0.254: U$1.GPIO16 52.03,88.64 50.9,89.76 SJ2.1 SJ2.2 44.73,89.76 40.23,85.27 IC4.4
IGPT_GND
  Top 0.813: OK13.2 OK15.3 41.15,10.14 41.15,4.65 IGPT.2
N$1
  Top 1.27: OK5.4 3.28,8.84 4.57,7.54 6.55,7.54 7.77,6.32 X1.2
N$2
  Top 0.305: R27.1 17.55,75.46 18.95,76.86 IC2.3
  Top 0.508: R27.1 5.87,75.46 P.S.3
N$3
  Top 0.406: U$1.REST 55.65,94.62 R7.1
N$4
  Top 0.406: U$1.CH_PD 53.23,90.64 51.44,92.43 R8.1
N$5
  Top 0.305: U1.20 63.4,45.84 C2.+
N$6
  Top 1.27: OK7.4 21.29,9.17 17.93,5.82 X1.4
N$7
  Top 0.254: R11.1 78.41,20.7 OK14.1
N$8
  Top 0.254: R2.1 56.52,21.23 OK3.1
N$9
  Top 0.254: R19.1 72.97,20.85 OK1.1
N$10
  Top 1.27: OK6.4 12.27,4.83 X1.3
N$11
  Top 0.254: R20.1 67.56,20.93 OK2.1
N$12
  Top 0.254: R37.1 62.08,21 OK4.1
N$13
  Top 0.305: C13.2 12.62,61.11 R29.1
  Top 0.61: IC3.3 16.66,59 16,59.66 R29.1 8.69,59.66 7.7,58.67 5.77,58.67 L.S.2
N$14
  Top 0.305: D1.A 88.74,50.98 88.85,51.03 88.93,50.95 R23.2
N$15
  Top 0.305: 44.65,81.87 R25.2
  Top 0.813: D2.A 44.65,81.87
N$16
  Top 0.254: 87.4,16.15 D5.2
  Top 0.305: 78.95,10.82 OK14.4 78.61,13.23 79.63,14.25 84.8,14.25 D5.2
  Top 0.61: OK14.4 78.61,9.58 75.26,6.22 X2.5
N$17
  Top 0.305: OK1.4 72.85,11.28 72.85,11.89 72.85,13.94 74.14,15.24 83.59,15.24 84.43,16.08 D6.2
  Top 0.61: OK1.4 72.97,9.19 70.18,6.4 X2.4
N$18
  Top 0.254: 81.46,16.08 D7.2
  Top 0.305: D7.2 69.97,16.86 67.56,14.45 OK2.4
  Top 0.61: OK2.4 67.56,9.58 65.1,7.11 X2.3
N$19
  Top 0.61: 14.4,49.73 R30.1 9.58,49.73 8.53,48.69 L.S.4 | 14.4,49.73 14.83,49.73 15.39,50.29 IC3.5 | 14.4,49.73 14.83,49.3 C12.2
N$20
  Top 0.254: R32.2 OK15.1
N$21
  Top 0.305: R28.1 14.05,70.28 16.25,72.49 IC2.5
  Top 0.508: R28.1 5.97,70.28 P.S.4
N$22
  Top 0.305: D8.2 53.87,18.29 58.06,14.1 60.43,14.1 62.08,12.45 OK4.4
  Top 0.61: OK4.4 62.08,9.12 60.02,7.06 X2.2
N$23
  Top 0.305: D9.2 52.81,15.16 54.1,13.87 55.17,13.87 56.52,12.52 OK3.4
  Top 0.61: OK3.4 56.52,9.19 54.94,7.62 X2.1
N$24
  Top 0.406: R10.1 78.08,67.77 OK17.1
N$26
  Top 0.508: P.S.2 11.91,80.7 R38.1
N$27
  Top 0.305: OK5.1 8.36,22.06 R16.1
N$29
  Top 0.406: R10.2 86.33,73.03 SW.2
N$30
  Top 0.406: OK18.1 77.85,72.87 R14.1
N$31
  Top 0.406: R42.1 16.13,83.77 17.75,82.14 IC6.5
  Top 0.508: R41.2 R42.1
N$32
  Top 0.406: R39.2 15.16,88.88 R21.1 17.96,88.88 19.05,87.78 19.05,86.34 IC6.3
N$33
  Top 0.305: R17.1 17.3,19.93 17.25,19.88
  Top 0.406: 17.25,19.88 OK6.1
N$34  (via drill 0.35)
  Top 0.406: v16,78.49 14.91,78.49 R40.1 R38.2 | v18.59,82.91 19.02,82.47 IC6.6
  Bottom 0.406: v18.59,82.91 16,80.31 v16,78.49
N$35
  Top 0.406: R14.2 86.08,78.1 SW.3
N$37
  Top 0.305: R18.1 26.34,19.78 OK7.1
N$48
  Top 0.813: R31.1 35.53,13.92 36.6,12.85 OK13.1
OFF_SW
  Top 0.406: R15.2 50.43,82.64 U$1.GPIO13 58.25,82.64 63.17,77.72 63.17,73.53 64.01,72.69 65.39,72.69 OK18.4
ON_SW
  Top 0.305: 65.72,67.84 65.77,67.89 68.05,67.89 68.81,68.66 68.81,77.27 61.44,84.64 U$1.GPIO12
  Top 0.406: U$1.GPIO12 50.54,84.64 R13.2 | OK17.4 65.72,67.84
OP1
  Top 0.305: IC2.2 IC2.1 21.49,74.52 22.78,73.23 R3.1
OP2
  Top 0.305: IC2.6 IC2.7 20.22,71.3 R22.1
OP3
  Top 0.61: IC3.2 IC3.1 19.2,59.49 R24.1
OP4
  Top 0.61: IC3.6 IC3.7 17.93,50.42 18.44,49.91 19,49.91 R26.1
OP_I
  Top 0.406: R40.2 15.72,80.82 16.99,79.55 19.51,79.55 19.74,79.55 | IC6.7 20.29,80.11 19.74,79.55 | 19.74,79.55 23.32,79.55 23.93,80.16 R44.1
OP_V
  Top 0.406: R43.1 21.56,87.5 IC6.1 IC6.2
RX
  Top 0.305: U1.30 51.97,44.04 50.6,44.04 48.96,45.69 JP1.2
SCL
  Top 0.406: U$1.GPIO5 82.54,88.64 83.13,89.23 87.17,89.23 | R36.1 87.17,87.91 87.17,89.23 | 87.17,89.23 90.04,89.23 J4.4
SDA
  Top 0.406: U$1.GPIO4 80.43,90.64 80.85,91.06 84.35,91.06 R35.1 91.06,90.75 J4.3
TX
  Top 0.305: U1.31 52.21,42.67 47.47,42.67 JP2.2
VBAT
  Top 1.524: POWER.2 95.89,61.09 97.38,59.59 D11.1 R9.1
VOLTAGE+
  Top 0.508: P.S.1 6.55,86.61 R41.1 12.27,88.88 R39.1
(copper drawn outside any net)
  shapes: Top area x2

### Text on the board
tPlace: B | A | TX | RX | 5v | SDA | SCL | OFF | ON | SUDU Industrial | QSXX_1.6 | ICSP | S | QS40_1.6 | SSR | AC(PWR+IO) | 2
bPlace: RX | GND | 0 | TX | 5V | B | A | GND | P_SGNL | OFF | 5V | ON | P_SGNL | 5V | GND | V BAT | LVL_SGNL | SuduIndustrial.COM | MADE IN UAE | SUDU Specialized Industrial | GND | GND | Machinery and Equipment Manufacturing | LVL_SGNL | GND | TEMP_SGNL | 5V | N | 3 2 1 | L | L | FB | GND | CTRL | 5 4 3 2 1 | GND | 24v